# Altium schematic sheet Sheet_1_2025-12-18.schdoc
size 91 x 80 mm
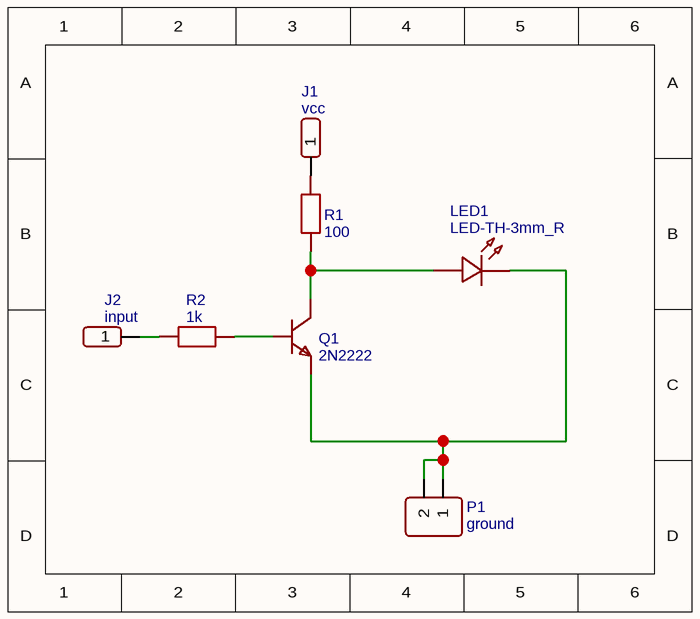
[diagram p0: Sheet_1_2025-12-18.schdoc]

## Parts
J1  vcc  [HDR-M-2.54_1X1]
J2  input  [HDR-M-2.54_1X1]
LED1  LED-TH-3mm_R  [LED-TH_BD3.0_RED]
P1  ground  [CONN-TH_2P-P5.00]
Q1  2N2222  [TO-92-3_L4.9-W3.7-P1.27-L]
R1  100  [R_AXIAL-0.3]
R2  1k  [R_AXIAL-0.3]

## Nets
NetJ1_1: J1.1 R1.2
NetJ2_1: J2.1 R2.2
NetLED1_1: LED1.1 Q1.3(C) R1.1
NetLED1_2: LED1.2 P1.1 P1.2 Q1.1(E)
NetQ1_2: Q1.2(B) R2.1

## Library data of the parts
J1 = vcc: Contributor: LCEDA_Lib; Supplier Part: C81276; Supplier: LCSC; spicePre: J; spiceSymbolName: HDR-M-2.54_1x1
J2 = input: Contributor: LCEDA_Lib; Supplier Part: C81276; Supplier: LCSC; spicePre: J; spiceSymbolName: HDR-M-2.54_1x1
LED1 = LED-TH-3mm_R: Manufacturer: EVERLIGHT(台湾亿光); Manufacturer Part: 204-10SDRD/S530-A3-L; Contributor: LCEDA_Lib; Supplier Part: C84774; Supplier: LCSC; spicePre: L; spiceSymbolName: LED-TH-3mm_R
P1 = ground: Contributor: LCEDA_Lib; Supplier: LCSC; spicePre: P; spiceSymbolName: CONN-TH_2P-P5.00
Q1 = 2N2222: Manufacturer: ST(先科); Manufacturer Part: 2N2222A; Contributor: LCSC; Supplier: LCSC; Supplier Part: C118536; JLCPCB Part Class: Extended Part; spicePre: Q; spiceSymbolName: 2N2222
R1 = 100: nameAlias: Value(Ω); Contributor: LCEDA_Lib; spicePre: R; spiceSymbolName: R_AXIAL-0.3_EU
R2 = 1k: nameAlias: Value(Ω); Contributor: LCEDA_Lib; spicePre: R; spiceSymbolName: R_AXIAL-0.3_EU